# Altium schematic sheet 00.ChangeLog.SchDoc: ARES_R30_Power
size A4; CompanyName: HIGEN; DrawnBy: 212084; Revision: V0.21; SheetNumber: 0; SheetTotal: 5; DrawingNumber: 임시도면
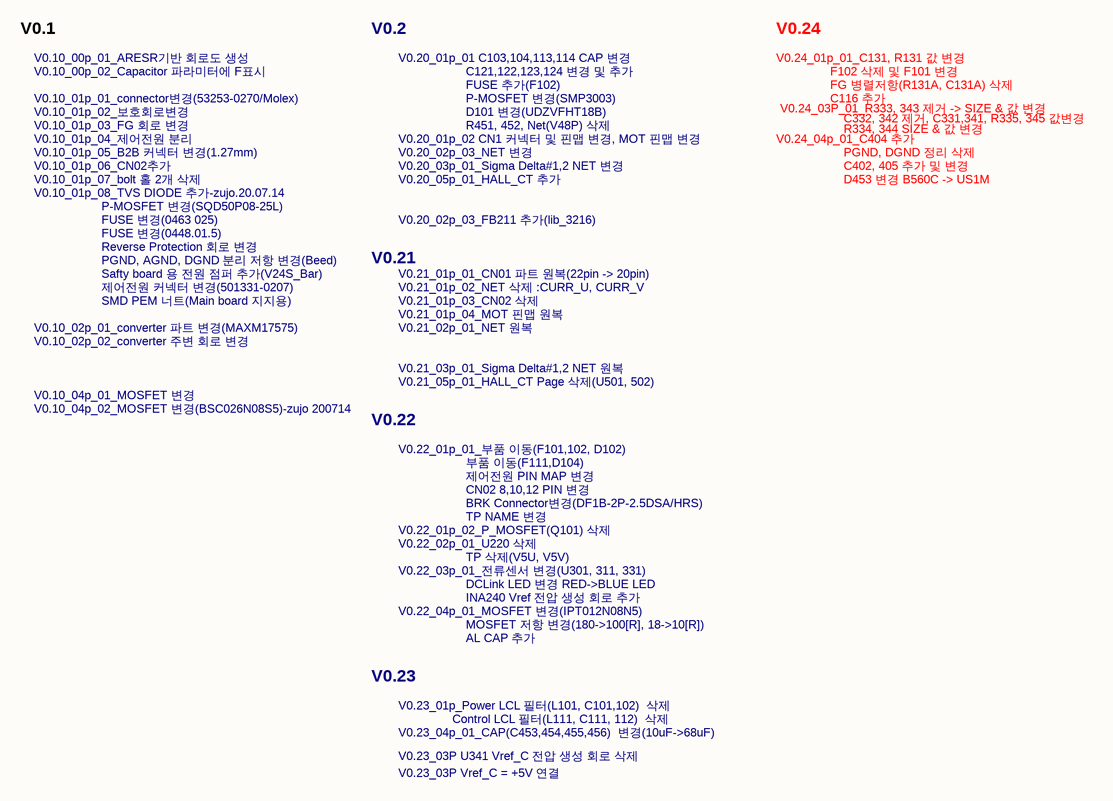
[diagram p0: 00.ChangeLog.SchDoc]

## Notes on the sheet
- V0.1
- V0.2
- V0.24
- V0.10_00p_01_ARESR기반 회로도 생성
- V0.10_00p_02_Capacitor 파라미터에 F표시
- V0.10_01p_01_connector변경(53253-0270/Molex)
- V0.10_01p_02_보호회로변경
- V0.20_01p_01 C103,104,113,114 CAP 변경
- C121,122,123,124 변경 및 추가
- FUSE 추가(F102)
- D101 변경(UDZVFHT18B)
- P-MOSFET 변경(SMP3003)
- V0.24_01p_01_C131, R131 값 변경
- V0.24_03P_01_R333, 343 제거 -> SIZE & 값 변경
- FG 병렬저항(R131A, C131A) 삭제
- F102 삭제 및 F101 변경
- C116 추가
- V0.10_01p_03_FG 회로 변경
- V0.10_01p_04_제어전원 분리
- V0.10_01p_05_B2B 커넥터 변경(1.27mm)
- V0.10_01p_06_CN02추가
- V0.10_01p_07_bolt 홀 2개 삭제
- V0.20_05p_01_HALL_CT 추가
- V0.20_02p_03_NET 변경
- V0.20_03p_01_Sigma Delta#1,2 NET 변경
- V0.20_01p_02 CN1 커넥터 및 핀맵 변경, MOT 핀맵 변경
- R451, 452, Net(V48P) 삭제
- V0.24_04p_01_C404 추가
- R334, 344 SIZE & 값 변경
- C332, 342 제거, C331,341, R335, 345 값변경
- PGND, DGND 정리 삭제
- C402, 405 추가 및 변경
- D453 변경 B560C -> US1M
- V0.10_01p_08_TVS DIODE 추가-zujo.20.07.14
- Reverse Protection 회로 변경
- FUSE 변경(0463 025)
- FUSE 변경(0448.01.5)
- P-MOSFET 변경(SQD50P08-25L)
- V0.20_02p_03_FB211 추가(lib_3216)
- PGND, AGND, DGND 분리 저항 변경(Beed)
- Safty board 용 전원 점퍼 추가(V24S_Bar)
- 제어전원 커넥터 변경(501331-0207)
- SMD PEM 너트(Main board 지지용)
- V0.21
- V0.21_01p_01_CN01 파트 원복(22pin -> 20pin)
- V0.21_01p_03_CN02 삭제
- V0.21_01p_02_NET 삭제 :CURR_U, CURR_V
- V0.21_01p_04_MOT 핀맵 원복
- V0.10_02p_01_converter 파트 변경(MAXM17575)
- V0.10_02p_02_converter 주변 회로 변경
- V0.21_05p_01_HALL_CT Page 삭제(U501, 502)
- V0.21_03p_01_Sigma Delta#1,2 NET 원복
- V0.21_02p_01_NET 원복
- V0.10_04p_01_MOSFET 변경
- V0.10_04p_02_MOSFET 변경(BSC026N08S5)-zujo 200714
- V0.22
- V0.22_01p_01_부품 이동(F101,102, D102)
- CN02 8,10,12 PIN 변경
- 제어전원 PIN MAP 변경
- 부품 이동(F111,D104)
- BRK Connector변경(DF1B-2P-2.5DSA/HRS)
- TP NAME 변경
- V0.22_02p_01_U220 삭제
- V0.22_03p_01_전류센서 변경(U301, 311, 331)
- V0.22_01p_02_P_MOSFET(Q101) 삭제
- TP 삭제(V5U, V5V)
- DCLink LED 변경 RED->BLUE LED
- V0.22_04p_01_MOSFET 변경(IPT012N08N5)
- INA240 Vref 전압 생성 회로 추가
- MOSFET 저항 변경(180->100[R], 18->10[R])
- AL CAP 추가
- V0.23
- V0.23_01p_Power LCL 필터(L101, C101,102)  삭제
- Control LCL 필터(L111, C111, 112)  삭제
- V0.23_04p_01_CAP(C453,454,455,456)  변경(10uF->68uF)
- V0.23_03P U341 Vref_C 전압 생성 회로 삭제
- V0.23_03P Vref_C = +5V 연결
- -
- DWG.
- UNIT
- DESIGNED
- mm
- CHECKED
- SCALE
- APPROVED
- N/S
- TITLE
- HIGEN
- Related DWG. No.
- SUBJECT
- DWG. No.
- Ver.